# EasyEDA schematic SCH_Elektrisch Schema B_2022-10-21.json
TITLE: Linefillower; REV: 1.0; Date: 2022-10-09; Sheet: 1/1; Drawn By: Robbe Malfroot; Company: Hogent
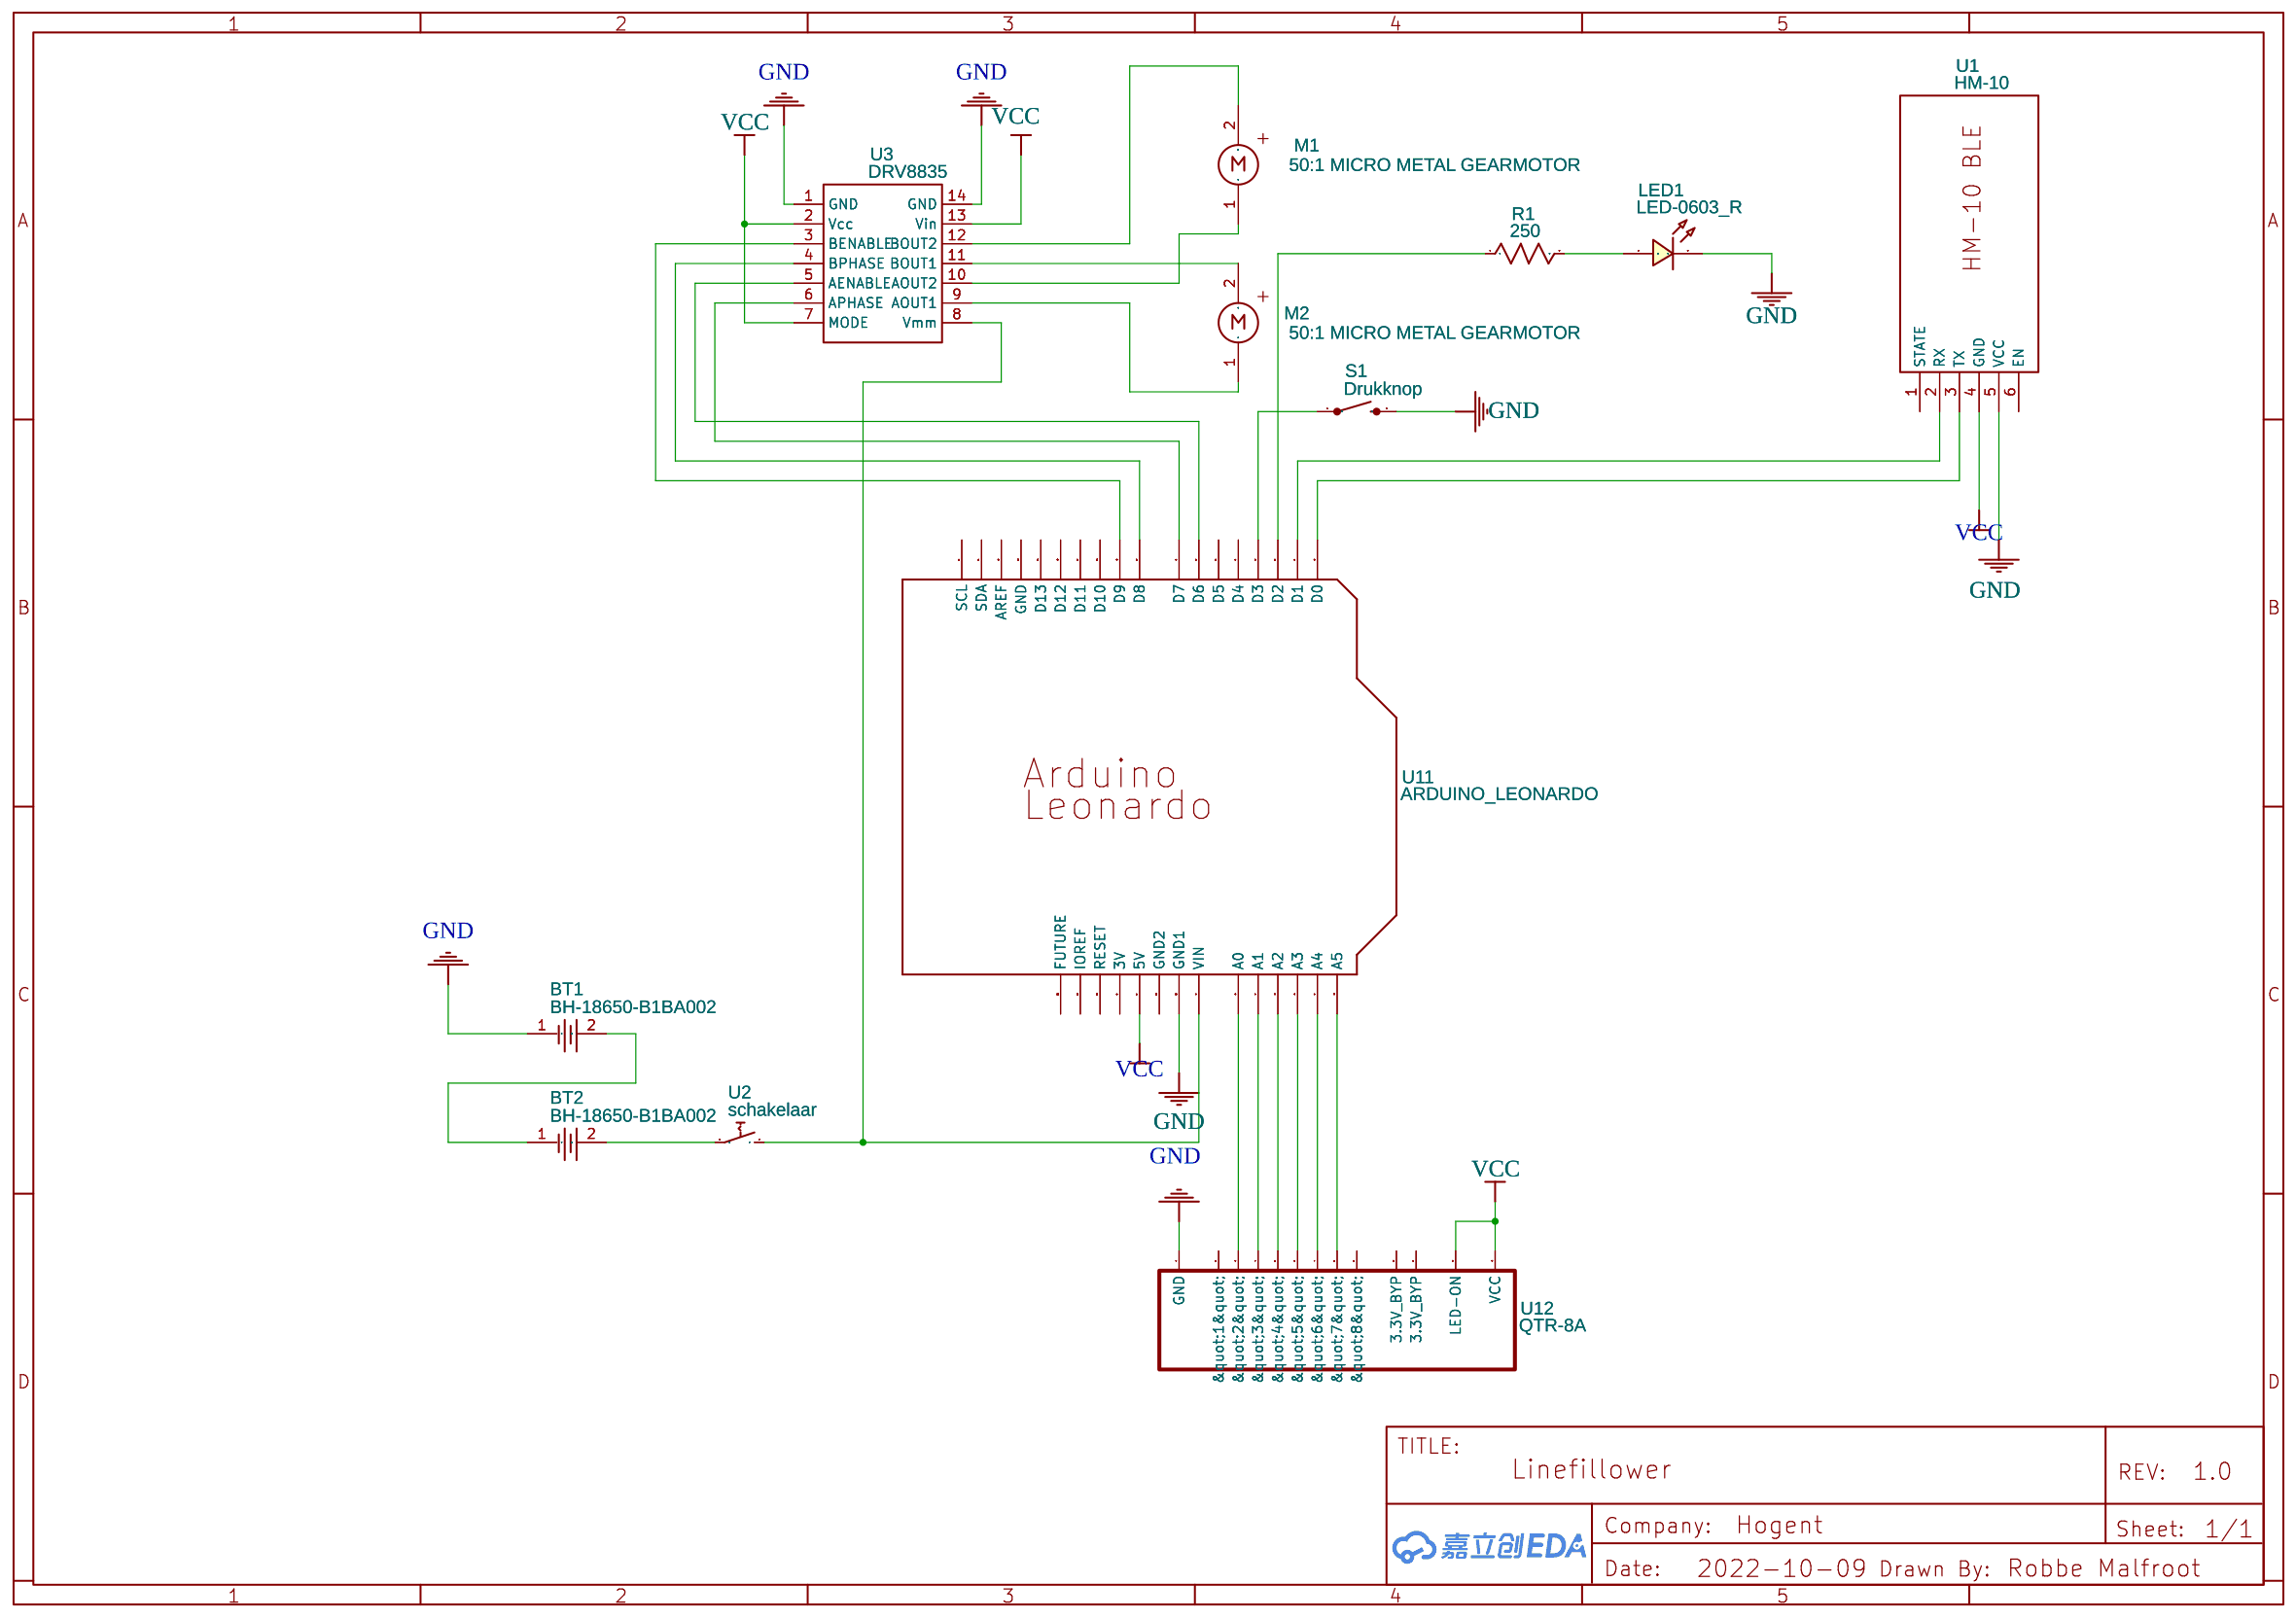
[diagram p0: schematic sheet]

## Parts
BT1  BH-18650-B1BA002  [BATTERY-SMD_18650-1S-L77.1-W20.7-1]
BT2  BH-18650-B1BA002  [BATTERY-SMD_18650-1S-L77.1-W20.7-1]
LED1  LED-0603_R  [LED0603_RED]
M1  50:1 MICRO METAL GEARMOTOR  [POLOLU-3071]
M2  50:1 MICRO METAL GEARMOTOR  [POLOLU-3071]
R1  250  [R0603]
S1  Drukknop  [DRUKKNOP-PCB]
U1  HM-10  [HM-10 LATEST]
U2  schakelaar
U3  DRV8835  [DRV8835]
U11  ARDUINO_LEONARDO  [ARDUINO_LEONARDO]
U12  QTR-8A  [QTR-8A/8RC]

## Library data of the parts
BT1 BT2 = BH-18650-B1BA002: Supplier: LCSC; Supplier Part: C2988620; Manufacturer: MYOUNG(美阳); link: https://atta.szlcsc.com/upload/public/pdf/source/20220402/870DB99AB50CA0DF8D51CF7C86A51FAB.pdf; Contributor: lcsc; JLCPCB Part Class: Extended Part
LED1 = LED-0603_R: Manufacturer: EVERLIGHT(台湾亿光); Manufacturer Part: 19-217/R6C-AL1M2VY/3T; Supplier Part: C72044; Supplier: LCSC; Contributor: LCEDA_01
M1 M2 = 10:1 MICRO METAL GEARMOTOR eskere: Manufacturer: Pololu; Manufacturer Part: 10:1 Micro Metal Gearmotor HPCB 6V with Extended Motor Shaft; Supplier: Pololu; Supplier Part: 3071; link: https://www.pololu.com/product/3071; Contributor: cheght
R1 = R_0603_US: Contributor: LCEDA_Lib
S1 = Drukknop: Various NO switches- pushbuttons, reed, etc; Contributor: Dompie
U1 = HM-10: Contributor: jmprice50
U2 = schakelaar: Contributor: onschacline
U3 = DRV8835: Contributor: Mustafa Mutlu
U11 = ARDUINO_LEONARDO
U12 = QTR-8A: Manufacturer: Pololu; Supplier: Pololu; Supplier Part: 960; link: https://www.pololu.com/docs/pdf/0J12/QTR-8x.pdf; Contributor: Junikos

## Nets
GND: BT1.1 LED1.2 S1.2 U1.5(VCC) U3.1(GND) U3.14(GND) U11.GND$3(GND1) U12.1(GND)
VCC: U1.4(GND) U3.2(Vcc) U3.7(MODE) U3.13(Vin) U11.5V U12.12(LED-ON)
Net-(BT1-2): BT1.2 BT2.1
Net-(BT2-2): BT2.2 U2.2
Net-(LED1-1): LED1.1 R1.2
Net-(M1-1): M1.1 U3.10(AOUT2)
Net-(M1-2): M1.2 U3.12(BOUT2)
Net-(M2-1): M2.1 U3.9(AOUT1)
Net-(M2-2): M2.2 U3.11(BOUT1)
Net-(R1-1): R1.1 U11.D2
Net-(S1-1): S1.1 U11.D3
Net-(U1-2): U1.2(RX) U11.D1
Net-(U1-3): U1.3(TX) U11.D0
Net-(U2-1): U2.1 U3.8(Vmm) U11.VIN
Net-(U3-3): U3.3(BENABLE) U11.D9
Net-(U3-4): U3.4(BPHASE) U11.D8
Net-(U3-5): U3.5(AENABLE) U11.D6
Net-(U3-6): U3.6(APHASE) U11.D7
Net-(U11-A0): U11.A0 U12.3("2")
Net-(U11-A1): U11.A1 U12.4("3")
Net-(U11-A2): U11.A2 U12.5("4")
Net-(U11-A3): U11.A3 U12.6("5")
Net-(U11-A4): U11.A4 U12.7("6")
Net-(U11-A5): U11.A5 U12.8("7")

Not connected (* = marked no-connect by the designer): U1 1(STATE) 6(EN); U11 3V AREF D4 D5 D10 D11 D12 D13 GND GND$2(GND2) IOREF RESERVED(FUTURE) RESET SCL SDA; U12 2("1") 9("8") 10(3.3V BYP) 11(3.3V BYP)
